# EAGLE design juliusledarray-v0.1 (EAGLE 7.0.0)
CNAME: Julius LED; CREVISION: v0.1; DESIGNER: shrkey; SCHEMATICV1: Lighting array for Julius ROV
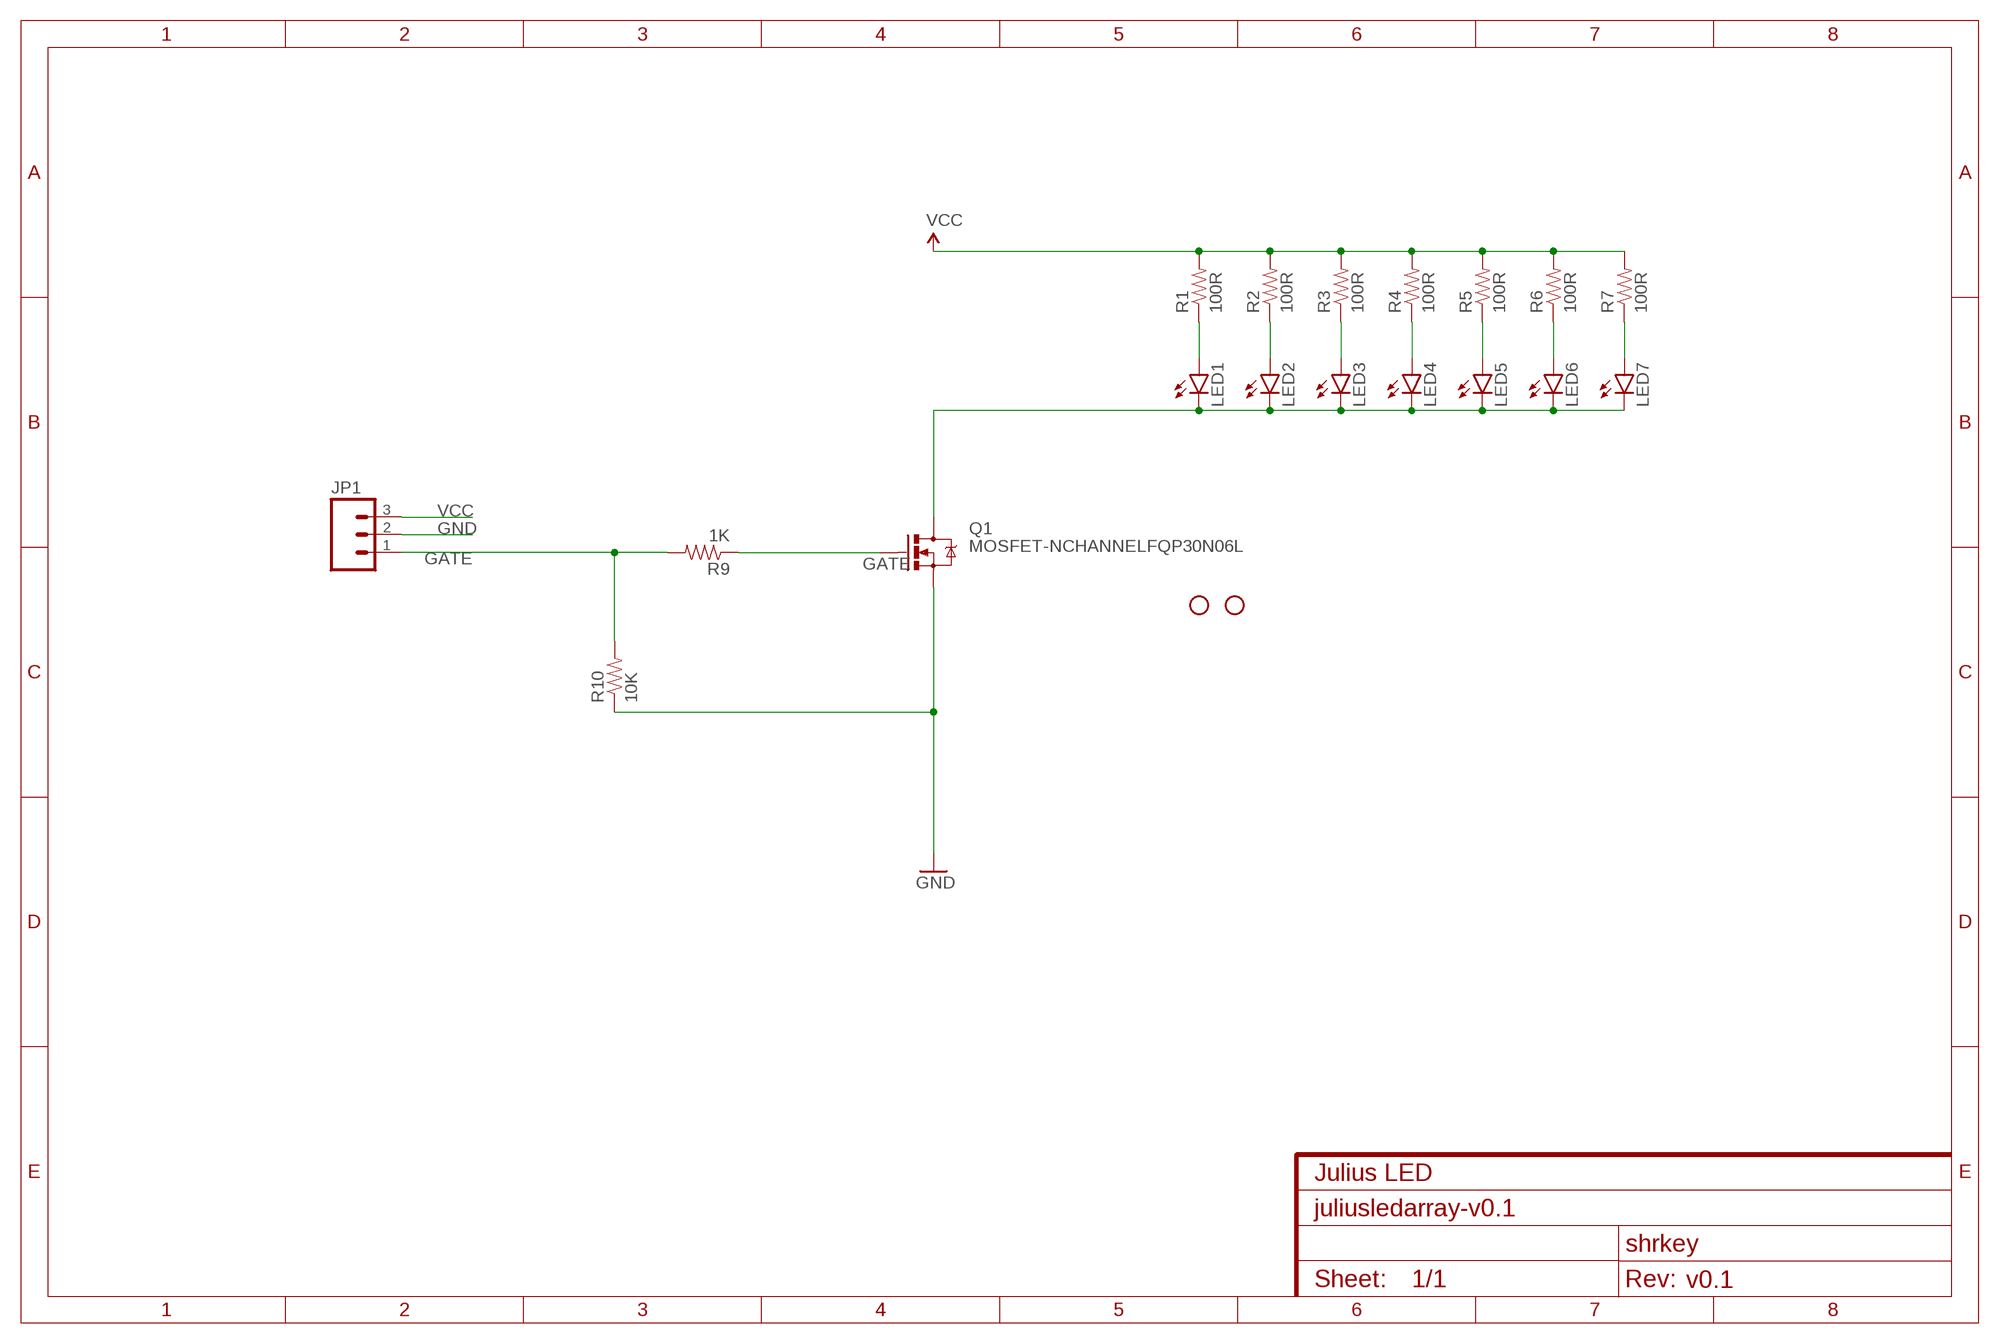
[diagram p0: schematic, sheet 1]

## Parts
JP1  M03LOCK_LONGPADS  [1X03_LOCK_LONGPADS]
LED1  LED5MM  [LED5MM]
LED2  LED5MM  [LED5MM]
LED3  LED5MM  [LED5MM]
LED4  LED5MM  [LED5MM]
LED5  LED5MM  [LED5MM]
LED6  LED5MM  [LED5MM]
LED7  LED5MM  [LED5MM]
Q1  MOSFET-NCHANNELFQP30N06L  [TO220V]
R1  100R  RESISTOR0805-RES  [0805]
R2  100R  RESISTOR0805-RES  [0805]
R3  100R  RESISTOR0805-RES  [0805]
R4  100R  RESISTOR0805-RES  [0805]
R5  100R  RESISTOR0805-RES  [0805]
R6  100R  RESISTOR0805-RES  [0805]
R7  100R  RESISTOR0805-RES  [0805]
R9  1K  RESISTOR0805-RES  [0805]
R10  10K  RESISTOR0805-RES  [0805]
STANDOFF1  STAND-OFF  [STAND-OFF]
STANDOFF2  STAND-OFF  [STAND-OFF]

## Nets
GATE: JP1.1 R9.2 R10.2
GND: JP1.2 Q1.3(S) R10.1
N$1: LED1.A R1.1
N$2: LED2.A R2.1
N$3: LED3.A R3.1
N$4: LED4.A R4.1
N$5: Q1.1(G) R9.1
N$6: LED5.A R5.1
N$7: LED6.A R6.1
N$8: LED7.A R7.1
N$10: LED1.K(C) LED2.K(C) LED3.K(C) LED4.K(C) LED5.K(C) LED6.K(C) LED7.K(C) Q1.2(D)
VCC: JP1.3 R1.2 R2.2 R3.2 R4.2 R5.2 R6.2 R7.2

## Library data of the parts
JP1 = SparkFun-Connectors:M03: Header 3 Standard 3-pin 0.1" header. Use with straight break away headers (SKU : PRT-00116), right angle break away headers (PRT-00553), swiss pins (PRT-00743), machine pins (PRT-00117), and female headers (PRT-00115). Molex polarized connector foot print use with SKU : PRT-08232 with associated crimp pins and housings.
LED1-LED7 = SparkFun-LED:LED: LEDs Standard schematic elements and footprints for 5mm, 3mm, 1206, and 0603 sized LEDs. 5mm - Spark Fun Electronics SKU : COM-00529 (and others)
Q1 = SparkFun-DiscreteSemi:MOSFET-NCHANNEL: Common NMOSFET Parts MFG P/N Store ID Prod ID FDD8780 TRANS-09984 SI7820DN TRANS-11055 FDS6630A IC-08089 2N7002PW TRANS-11151 FQP30N06L COM-10213 TRANS-10060 BSS123LT1G TRANS-08345 BSS138 TRANS-00830 BS170 2N7000; PROD_ID: TRANS-10060
R1-R7 R9 R10 = SparkFun-Passives:RESISTOR: Resistor Basic schematic elements and footprints for 0603, 1206, and PTH resistors.
STANDOFF1 STANDOFF2 = SparkFun-Electromechanical:STAND-OFF: #4 Stand Off This is the mechanical footprint for a #4 phillips button head screw. Use the keepout ring to avoid running the screw head into surrounding components. SKU : PRT-00447

## Board
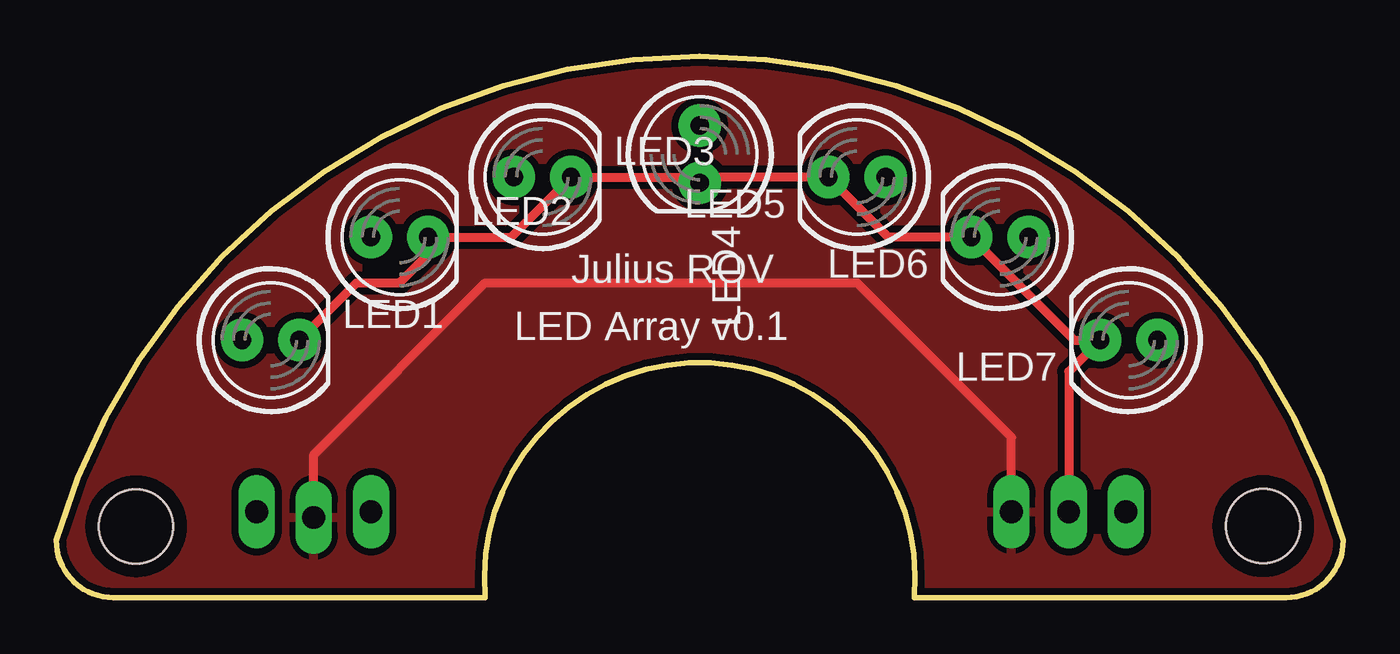
[diagram p1: board, top side]
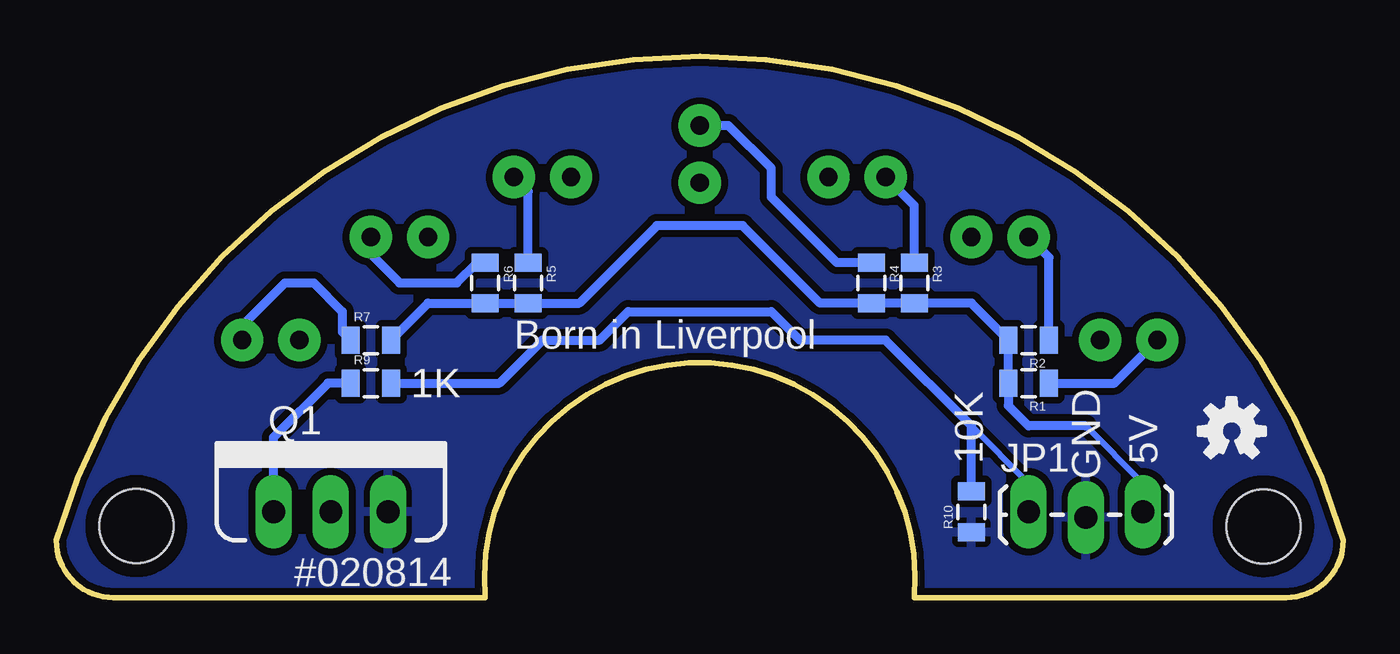
[diagram p2: board, bottom side, seen from below]

Size 57.15 x 24.03 mm. Coordinates in mm from the lower left corner, seen from the top.
Outline: 19.05,0 arc-190 38.1,0 54.61,0 arc90 57.15,2.54 arc148 0,2.54 arc90 2.54,0 19.05,0
Copper layers (1*16): Top 0.035mm / dielectric 1.5mm / Bottom 0.035mm
Design rules "SparkFun-2-layer": minimum track width 7mil, minimum drill 15mil, track to track 8mil, track to pad 8mil, pad to pad 8mil, via to via 8mil, smd to smd 8mil, copper to edge 8mil, drill to drill 8mil, minimum pad ring 12mil, minimum via ring 10mil, stop-mask expansion 4mil, vias tented up to drill 20mil, thermal gap 10mil

### Footprints (pad centres in the part's own frame; a part is rotated, then mirrored left to right if it is on the bottom)
1X03_LOCK_LONGPADS = drill 1.016 long: 1 0,0; 2 2.54,-0.254; 3 5.08,0
LED5MM = drill 0.813 pad 1.88: A -1.27,0; K 1.27,0
TO220V = drill 1.016 long: 1 -2.54,0; 2 0,0; 3 2.54,0
0805 = smd 0.8 x 1.2: 1 -0.9,0; 2 0.9,0
STAND-OFF = hole 3.302: 0,0

### Placement (x,y rotation side)
JP1  13.97,3.81 0 bottom
LED1  9.53,11.43 0 top
LED2  15.24,16 0 top
LED3  21.59,18.67 0 top
LED4  28.57,19.68 270 top
LED5  35.56,18.67 180 top
LED6  41.91,16 180 top
LED7  47.62,11.43 180 top
Q1  44.96,3.81 0 bottom
R1  13.97,9.53 180 bottom
R2  13.97,11.43 180 bottom
R3  19.05,13.97 270 bottom
R4  20.95,13.97 270 bottom
R5  36.2,13.97 270 bottom
R6  38.1,13.97 270 bottom
R7  43.18,11.43 0 bottom
R9  43.18,9.53 0 bottom
R10  16.51,3.81 90 bottom
STANDOFF1  53.59,3.17 0 top
STANDOFF2  3.54,3.16 0 top
U$1  [OSHW-LOGO-S]  4.95,7.39 0 bottom

### Tracks (layer width: path | path; a pad name or v marks a point on that pad's centre or on a via)
GATE
  Bottom 0.254: JP1.1 13.97,5.08 16.51,7.62
  Bottom 0.406: R9.2 37.47,9.53 35.56,11.43 33.02,11.43 31.75,12.7 25.4,12.7 24.13,11.43 20.32,11.43 16.51,7.62 R10.2
GND
  Top 0.406: Q1.3 42.42,7.11 35.56,13.97 19.05,13.97 11.43,6.35 JP1.2
  pour Bottom (isolate 0.305): 2.54,0 54.61,0 arc90 57.15,2.54 arc180 0,2.54 arc90
  pour Top (isolate 0.305): 2.54,0 54.61,0 arc90 57.15,2.54 arc180 0,2.54 arc90
N$1
  Bottom 0.406: R1.1 10.16,9.53 LED1.A
N$2
  Bottom 0.406: R2.1 13.07,15.1 LED2.A
N$3
  Bottom 0.406: R3.1 19.05,17.4 LED3.A
N$4
  Bottom 0.406: R4.1 22.49,14.87 25.4,17.78 25.4,19.05 27.3,20.95 LED4.A
N$5
  Bottom 0.406: Q1.1 47.5,7.11 45.09,9.53 R9.1
N$6
  Bottom 0.406: R5.1 36.2,18.03 LED5.A
N$7
  Bottom 0.406: R6.1 38.47,14.87 39.37,13.97 41.91,13.97 43.18,15.24 LED6.A
N$8
  Bottom 0.406: LED7.A 48.9,12.06 46.99,13.97 45.72,13.97 44.45,12.7 44.45,11.8 R7.1
N$10
  Top 0.406: Q1.2 44.96,10.03 LED7.K 45.21,11.43 LED6.K 36.96,16 LED5.K 28.83,18.67 LED4.K 28.32,18.67 LED3.K 20.19,16 LED2.K 16.51,15.24 15.24,13.97 13.34,13.97 LED1.K
VCC
  Bottom 0.254: JP1.3 8.89,5.08 11.43,7.62
  Bottom 0.406: 11.43,7.62 13.97,7.62 14.87,8.52 R1.2 R2.2 16.51,13.07 R3.2 R4.2 23.23,13.07 26.67,16.51 30.48,16.51 33.92,13.07 R5.2 R6.2 40.64,13.07 R7.2

### Text on the board
tPlace: Julius ROV | LED Array v0.1
bPlace: Born in Liverpool | GND | 10K | 1K | 5V | #020814